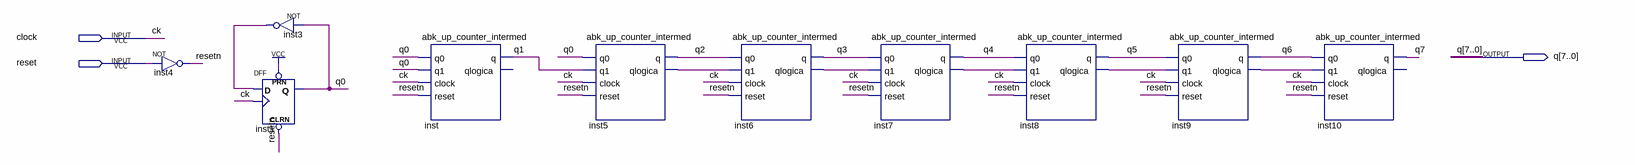
[diagram p0: schematic sheet]
// Quartus schematic abk_up_counter.bdf as structural Verilog: 10 symbols, 3 pins
module abk_up_counter (
  input  clock,
  input  reset,
  output [7:0] q
);

  wire inst3_out, inst5_qlogica, inst6_qlogica, inst7_qlogica, inst8_qlogica, inst9_qlogica, resetn;

  not inst4 (resetn, reset);
  DFF inst1 (.CLRN(resetn), .CLK(clock), .D(inst3_out), .PRN(1'b1), .Q(q[0]));
  not inst3 (inst3_out, q[0]);
  abk_up_counter_intermed inst (.q0(q[0]), .q1(q[0]), .clock(clock), .reset(resetn), .q(q[1]));  // open: qlogica
  abk_up_counter_intermed inst5 (
    .q0(q[0]), .q1(q[1]), .clock(clock), .reset(resetn), .q(q[2]), .qlogica(inst5_qlogica));
  abk_up_counter_intermed inst6 (
    .q0(q[2]), .q1(inst5_qlogica), .clock(clock), .reset(resetn), .q(q[3]), .qlogica(inst6_qlogica));
  abk_up_counter_intermed inst7 (
    .q0(q[3]), .q1(inst6_qlogica), .clock(clock), .reset(resetn), .q(q[4]), .qlogica(inst7_qlogica));
  abk_up_counter_intermed inst8 (
    .q0(q[4]), .q1(inst7_qlogica), .clock(clock), .reset(resetn), .q(q[5]), .qlogica(inst8_qlogica));
  abk_up_counter_intermed inst9 (
    .q0(q[5]), .q1(inst8_qlogica), .clock(clock), .reset(resetn), .q(q[6]), .qlogica(inst9_qlogica));
  abk_up_counter_intermed inst10 (
    .q0(q[6]), .q1(inst9_qlogica), .clock(clock), .reset(resetn), .q(q[7]));  // open: qlogica

  // Other names for the same wires on the sheet: ck = clock
endmodule
